# EAGLE design rpi-cc2538-uart (EAGLE 9.6.2)
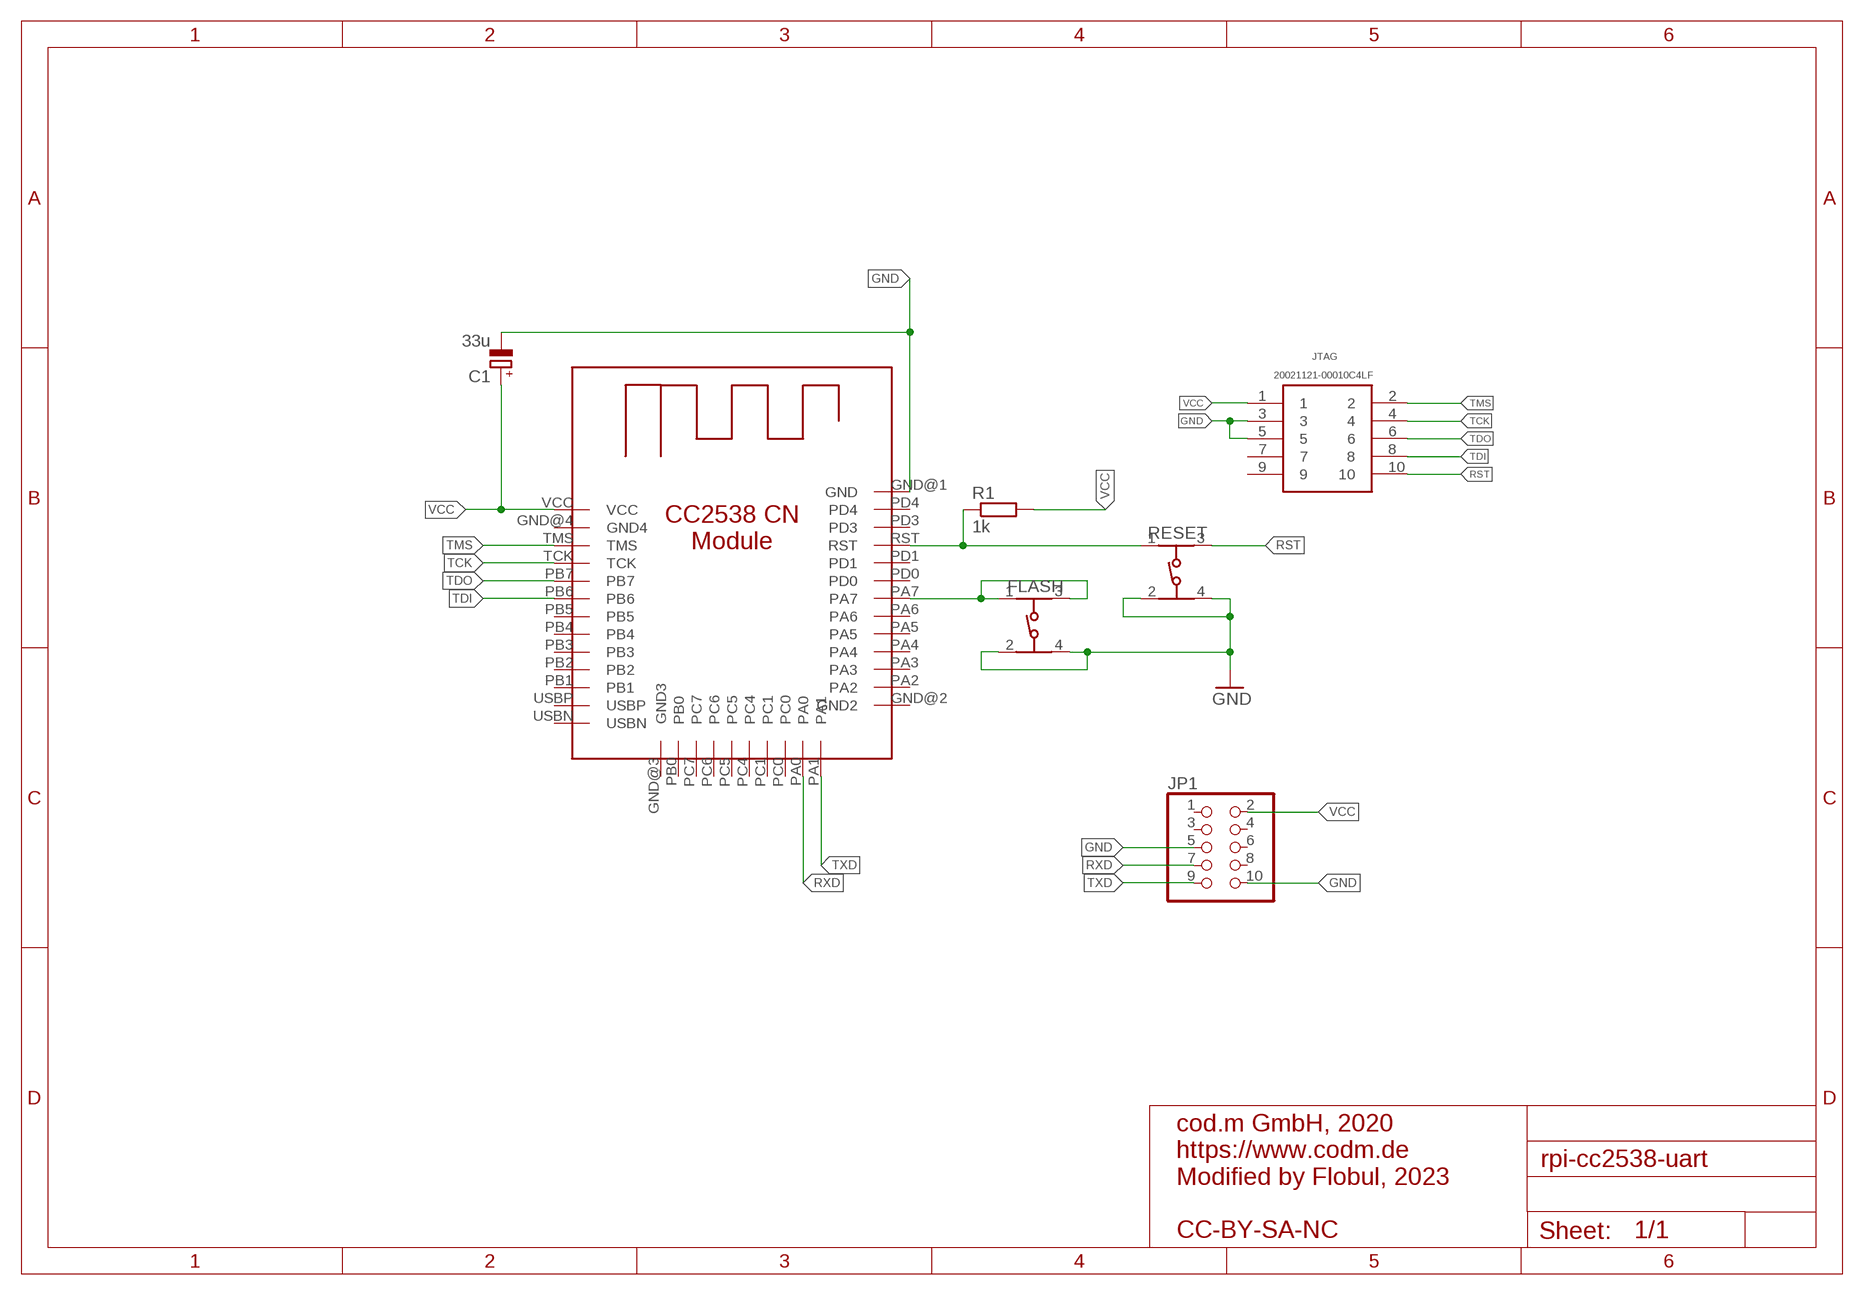
[diagram p0: schematic, sheet 1]

## Parts
C1  33u  CPOL-EUA/3216-18W  [A/3216-18W]
FLASH  434153017835  [434153017835]
JP1  PINHD-2X5  [2X05]
JTAG  20021121-00010C4LF  [2002112100010C4LF]
R1  1k  R-EU_R0805  [R0805]
RESET  434153017835  [434153017835]
U$1  CC2538-CN  [CC2538-CN]

## Nets
FLASH: FLASH.1 FLASH.3 U$1.PA7
GND: C1.- FLASH.2 FLASH.4 JP1.5 JP1.10 JTAG.3 JTAG.5 RESET.2 RESET.4 U$1.GND@1(GND)
RST: JTAG.10 R1.1 RESET.1 RESET.3 U$1.RST
RXD: JP1.7 U$1.PA0
TCK: JTAG.4 U$1.TCK
TDI: JTAG.8 U$1.PB6
TDO: JTAG.6 U$1.PB7
TMS: JTAG.2 U$1.TMS
TXD: JP1.9 U$1.PA1
VCC: C1.+ JP1.2 JTAG.1 R1.2 U$1.VCC
Unconnected: JP1.1 JP1.3 JP1.4 JP1.6 JP1.8 JTAG.7 JTAG.9 U$1.GND@2(GND2) U$1.GND@3(GND3) U$1.GND@4(GND4) U$1.PA2 U$1.PA3 U$1.PA4 U$1.PA5 U$1.PA6 U$1.PB0 U$1.PB1 U$1.PB2 U$1.PB3 U$1.PB4 U$1.PB5 U$1.PC0 U$1.PC1 U$1.PC4 U$1.PC5 U$1.PC6 U$1.PC7 U$1.PD0 U$1.PD1 U$1.PD3 U$1.PD4 U$1.USBN U$1.USBP

## Notes on the sheet
- cod.m GmbH, 2020
  https://www.codm.de
  Modified by Flobul, 2023
  
  CC-BY-SA-NC

## Library data of the parts
C1 = rcl:CPOL-EU: POLARIZED CAPACITOR, European symbol; SPICEPREFIX: C
FLASH RESET = 434153017835_Eagle_WS-TASV_rev20a:434153017835: WS-TASV J-Bend SMT Tact Switch 3.5x2.9 mm Material Properties Cover Material : Stainless Steel Properties Actuator Material:LCP Actuator Flammability Rating:UL94 V-0 Actuator Color:Blue Frame Material:PA46 Frame Flammability Rating:UL94 HB Frame Color:Black Contact Material:Stainless Steel Contact Plating:Silver Terminal Material:Copper Alloy Terminal Plating:Silver VR:12 V (DC) Contact Resistance Initial:100 mΩ Contact Resistance After Life Test:1 Ω RISO:100 MΩ Withstanding Voltage:250 V (AC) Washable:No Qty.:4000 Mechanical Properties Stroke :0.15 mm General Information Operating Temperature:-40 up to +85 °C Washable:No Packaging Properties Packaging:Tape and Reel <https://www.we-online.com/catalog/media/o72753v209%20WS-TASU_434331013822_a_4C.jpg> Details see: https://www.we-online.com/catalog/en/TASV_3_5X2_9_SMD_J-BEND/ Updated by yingchun,Shan;2020-02-18 2020(C) Würth Elektronik; DATASHEET-URL: https://www.we-online.com/catalog/datasheet/434153017835.pdf; H: 1.7mm; OPERATION-FORCE: 350g; PART-NUMBER: 434153017835; QTY: 4000
JP1 = pinhead:PINHD-2X5: PIN HEADER
JTAG = 20021121-00010C4LF:20021121-00010C4LF: Headers & Wire Housings 1.27x1.27mm BTB, Hdr Unshrd, SMT, 10 Pos Source: Datasheet; DESCRIPTION: Headers & Wire Housings 1.27x1.27mm BTB, Hdr Unshrd, SMT, 10 Pos; HEIGHT: 4.55mm; MANUFACTURER_NAME: Amphenol; MANUFACTURER_PART_NUMBER: 20021121-00010C4LF; MOUSER_PART_NUMBER: 649-202112100010C4LF; MOUSER_PRICE-STOCK: https://www.mouser.com/Search/Refine.aspx?Keyword=649-202112100010C4LF
R1 = rcl:R-EU_: RESISTOR, European symbol; SPICEPREFIX: R
U$1 = CC2538-CN:CC2538-CN: CC2538 + CC2592 typical Chinese Module black/green Credits 3D Model, take from uzsito's KiCad Component: https://github.com/uzsito/CC2538-CC2592-kicad-component

## Board
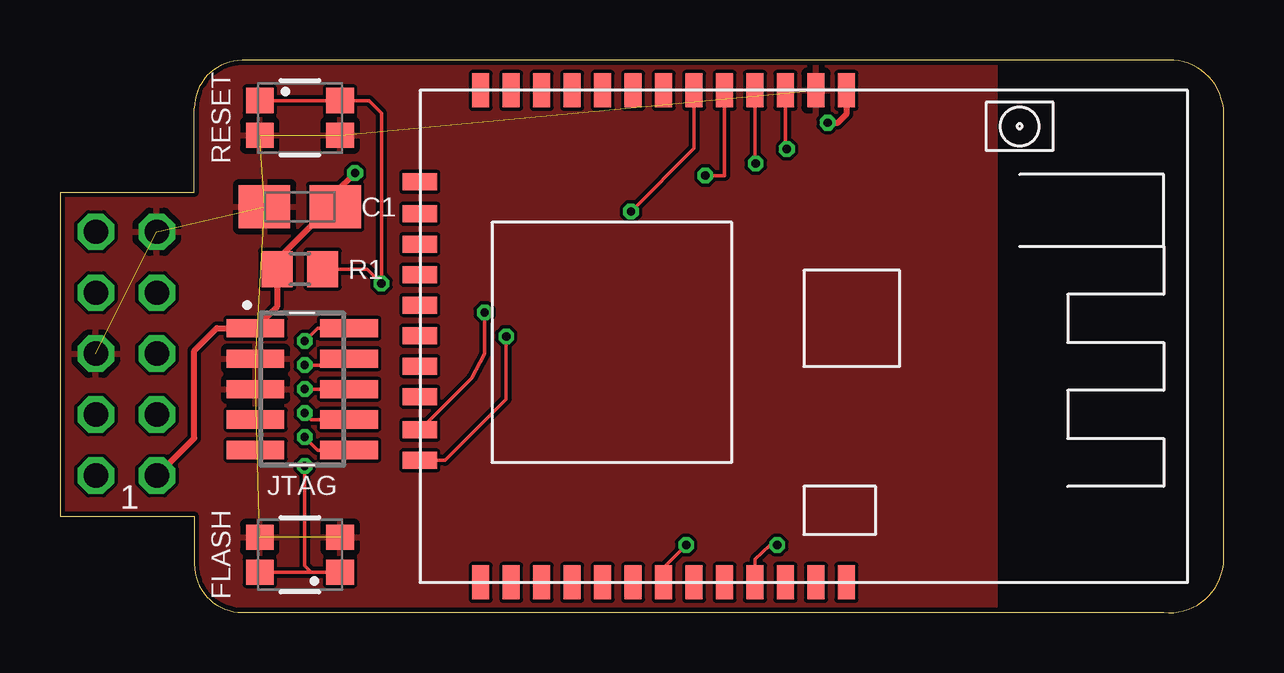
[diagram p1: board, top side]
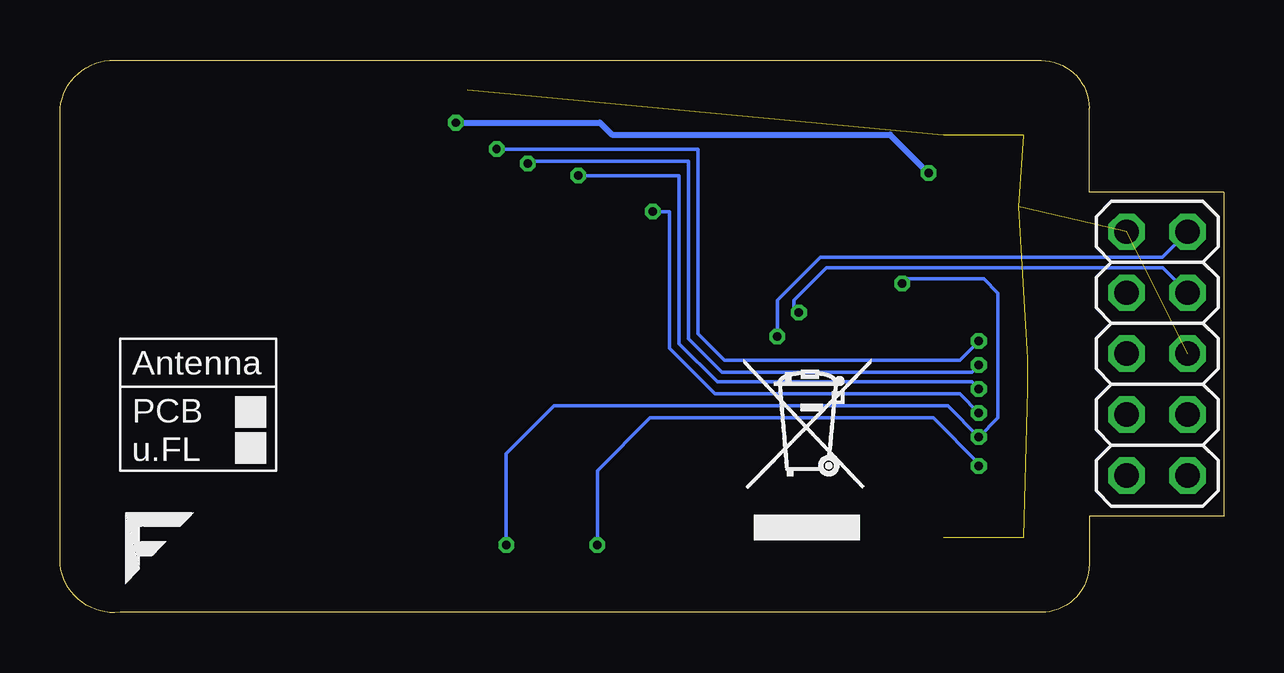
[diagram p2: board, bottom side, seen from below]

Size 48.5 x 23.03 mm. Coordinates in mm from the lower left corner, seen from the top.
Outline: 7.6,0.01 46,0.01 arc90 48.5,2.01 48.5,21.01 arc90 46,23.01 7.6,23.01 arc90 5.6,21.01 5.6,17.51 0,17.51 0,4.01 5.6,4.01 5.6,2.01 arc90 7.6,0.01
Copper layers (1*16): Top 0.035mm / dielectric 1.5mm / Bottom 0.035mm
Design rules "aisler_2_layer": minimum track width 0.1mm, minimum drill 0.2mm, track to track 0.15mm, track to pad 0.1mm, pad to pad 0.1mm, via to via 0.1mm, smd to smd 0.1mm, copper to edge 0.2mm, drill to drill 0.21mm, minimum pad ring 0.25mm, minimum via ring 0.15mm, stop-mask expansion 0mil, vias tented up to drill 0mil, thermal gap 10mil

### Footprints (pad centres in the part's own frame; a part is rotated, then mirrored left to right if it is on the bottom)
A/3216-18W = smd 2.15 x 1.8: + 1.475,0; - -1.475,0
434153017835 = smd 1.15 x 1.05: 1 -1.675,0.725; 2 -1.675,-0.725; 3 1.675,0.725; 4 1.675,-0.725
2X05 = drill 1.016 octagon: 1 -5.08,-1.27; 2 -5.08,1.27; 3 -2.54,-1.27; 4 -2.54,1.27; 5 0,-1.27; 6 0,1.27; 7 2.54,-1.27; 8 2.54,1.27; 9 5.08,-1.27; 10 5.08,1.27
2002112100010C4LF = smd 0.76 x 2.4: 1 -2.54,-1.95; 2 -2.54,1.95; 3 -1.27,-1.95; 4 -1.27,1.95; 5 0,-1.95; 6 0,1.95; 7 1.27,-1.95; 8 1.27,1.95; 9 2.54,-1.95; 10 2.54,1.95
R0805 = smd 1.3 x 1.5: 1 -0.95,0; 2 0.95,0
CC2538-CN = smd 0.711 x 1.422: GND@1 16.51,20.5; GND@2 17.78,0; GND@4 2.54,0; PA2 3.81,0; PA3 5.08,0; PA4 6.35,0; PA5 7.62,0; PA6 8.89,0; PA7 10.16,0; PB1 5.08,20.5; PB2 6.35,20.5; PB3 7.62,20.5; PB4 8.89,20.5; PB5 10.16,20.5; PB6 11.43,20.5; PB7 12.7,20.5; PD0 11.43,0; PD1 12.7,0; PD3 15.24,0; PD4 16.51,0; RST 13.97,0; TCK 13.97,20.5; TMS 15.24,20.5; USBN 2.54,20.5; USBP 3.81,20.5; VCC 17.78,20.5 | smd 1.422 x 0.711: GND@3 0,16.69; PA0 0,6.35; PA1 0,5.08; PB0 0,15.36; PC0 0,7.74; PC1 0,9.01; PC4 0,10.28; PC5 0,11.55; PC6 0,12.82; PC7 0,14.09

### Placement (x,y rotation side)
C1  10,16.91 0 top
FLASH  10,2.41 180 top
JP1  2.77,10.79 90 bottom
JTAG  10.1,9.31 270 top
R1  10,14.31 180 top
RESET  10,20.61 0 top
U$1  15,1.26 0 top
U$2  [LOGO_FLOBUL_2MM]  46,1.01 0 bottom
U$3  [WEEE-LOGO-5MM]  20,3.01 0 bottom

### Tracks (layer width: path | path; a pad name or v marks a point on that pad's centre or on a via)
FLASH  (via drill 0.35)
  Top 0.152: FLASH.3 FLASH.1 10.47,1.69 10.2,1.96 v10.2,6.11 | U$1.PA7 25.16,1.87 v26.1,2.81
  Bottom 0.152: v26.1,2.81 26.1,5.91 23.9,8.11 12.1,8.11 10.2,6.21 v10.2,6.11
GND  (9 unrouted)
  pour Top (isolate 0.15): 0,0.01 39,0.01 39,23.01 0,23.01
RST  (via drill 0.35)
  Top 0.152: JTAG.10 10.74,6.77 v10.2,7.31 | v29.9,2.81 29.6,2.81 28.97,2.22 U$1.RST | RESET.1 RESET.3 12.88,21.34 13.4,20.81 v13.4,13.71 12.8,14.31 R1.1
  Bottom 0.152: v29.9,2.81 29.9,6.61 27.9,8.61 11.5,8.61 v10.2,7.31 9.4,8.11 9.4,13.31 10,13.91 13.2,13.91 v13.4,13.71
RXD  (via drill 0.35)
  Top 0.152: v17.7,12.51 17.7,10.79 17.16,9.77 U$1.PA0
  Bottom 0.152: v17.7,12.51 17.9,12.71 17.9,13.01 16.55,14.36 2.53,14.36 JP1.7
TCK  (via drill 0.35)
  Top 0.152: JTAG.4 12.08,10.31 v10.2,10.31 | U$1.TCK 28.97,18.71 v29,18.71
  Bottom 0.152: v10.2,10.31 10.5,10.01 20.9,10.01 22.3,11.41 22.3,18.81 29,18.81 v29,18.71
TDI  (via drill 0.35)
  Top 0.152: JTAG.8 10.47,8.04 v10.2,8.31 | v23.8,16.71 26.43,19.34 U$1.PB6
  Bottom 0.152: v23.8,16.71 23.1,16.71 23.1,11.01 21.2,9.11 11,9.11 v10.2,8.31
TDO  (via drill 0.35)
  Top 0.152: JTAG.6 v10.2,9.31 | U$1.PB7 27.7,18.21 v26.9,18.21
  Bottom 0.152: v10.2,9.31 10.5,9.61 21.1,9.61 22.7,11.21 22.7,18.21 v26.9,18.21
TMS  (via drill 0.35)
  Top 0.152: JTAG.2 10.74,11.85 v10.2,11.31 | U$1.TMS 30.24,19.37 v30.3,19.31
  Bottom 0.152: v30.3,19.31 21.9,19.31 21.9,11.61 20.8,10.51 11,10.51 v10.2,11.31
TXD  (via drill 0.35)
  Top 0.152: v18.6,11.51 18.6,8.9 16.05,6.34 U$1.PA1
  Bottom 0.152: v18.6,11.51 18.6,13.01 16.8,14.81 2.55,14.81 JP1.9
VCC  (via drill 0.35)
  Top 0.254: U$1.VCC 32.78,20.76 32.43,20.41 v32,20.41 | JP1.2 5.6,7.27 5.6,10.91 6.54,11.85 JTAG.1 9.05,12.75 R1.2 9.05,14.71 11.25,16.91 C1.+ 11.47,17.51 12.28,18.31 v12.3,18.31
  Bottom 0.254: v12.3,18.31 13.9,19.91 25.5,19.91 26,20.41 v32,20.41

### Text on the board
tNames: 1
bNames: Antenna | PCB | u.FL